# Altium schematic sheet hat.SchDoc: Wacky Racers Group 25 Hat
size A3; DrawnBy: Bailey Lissington, Drew DeWet; Address1: ECE Department; Address2: University of Canterbury; Address3: Christchurch 8041; Address4: New Zealand; Revision: 1; ImagePath: ..\UCBlack.png
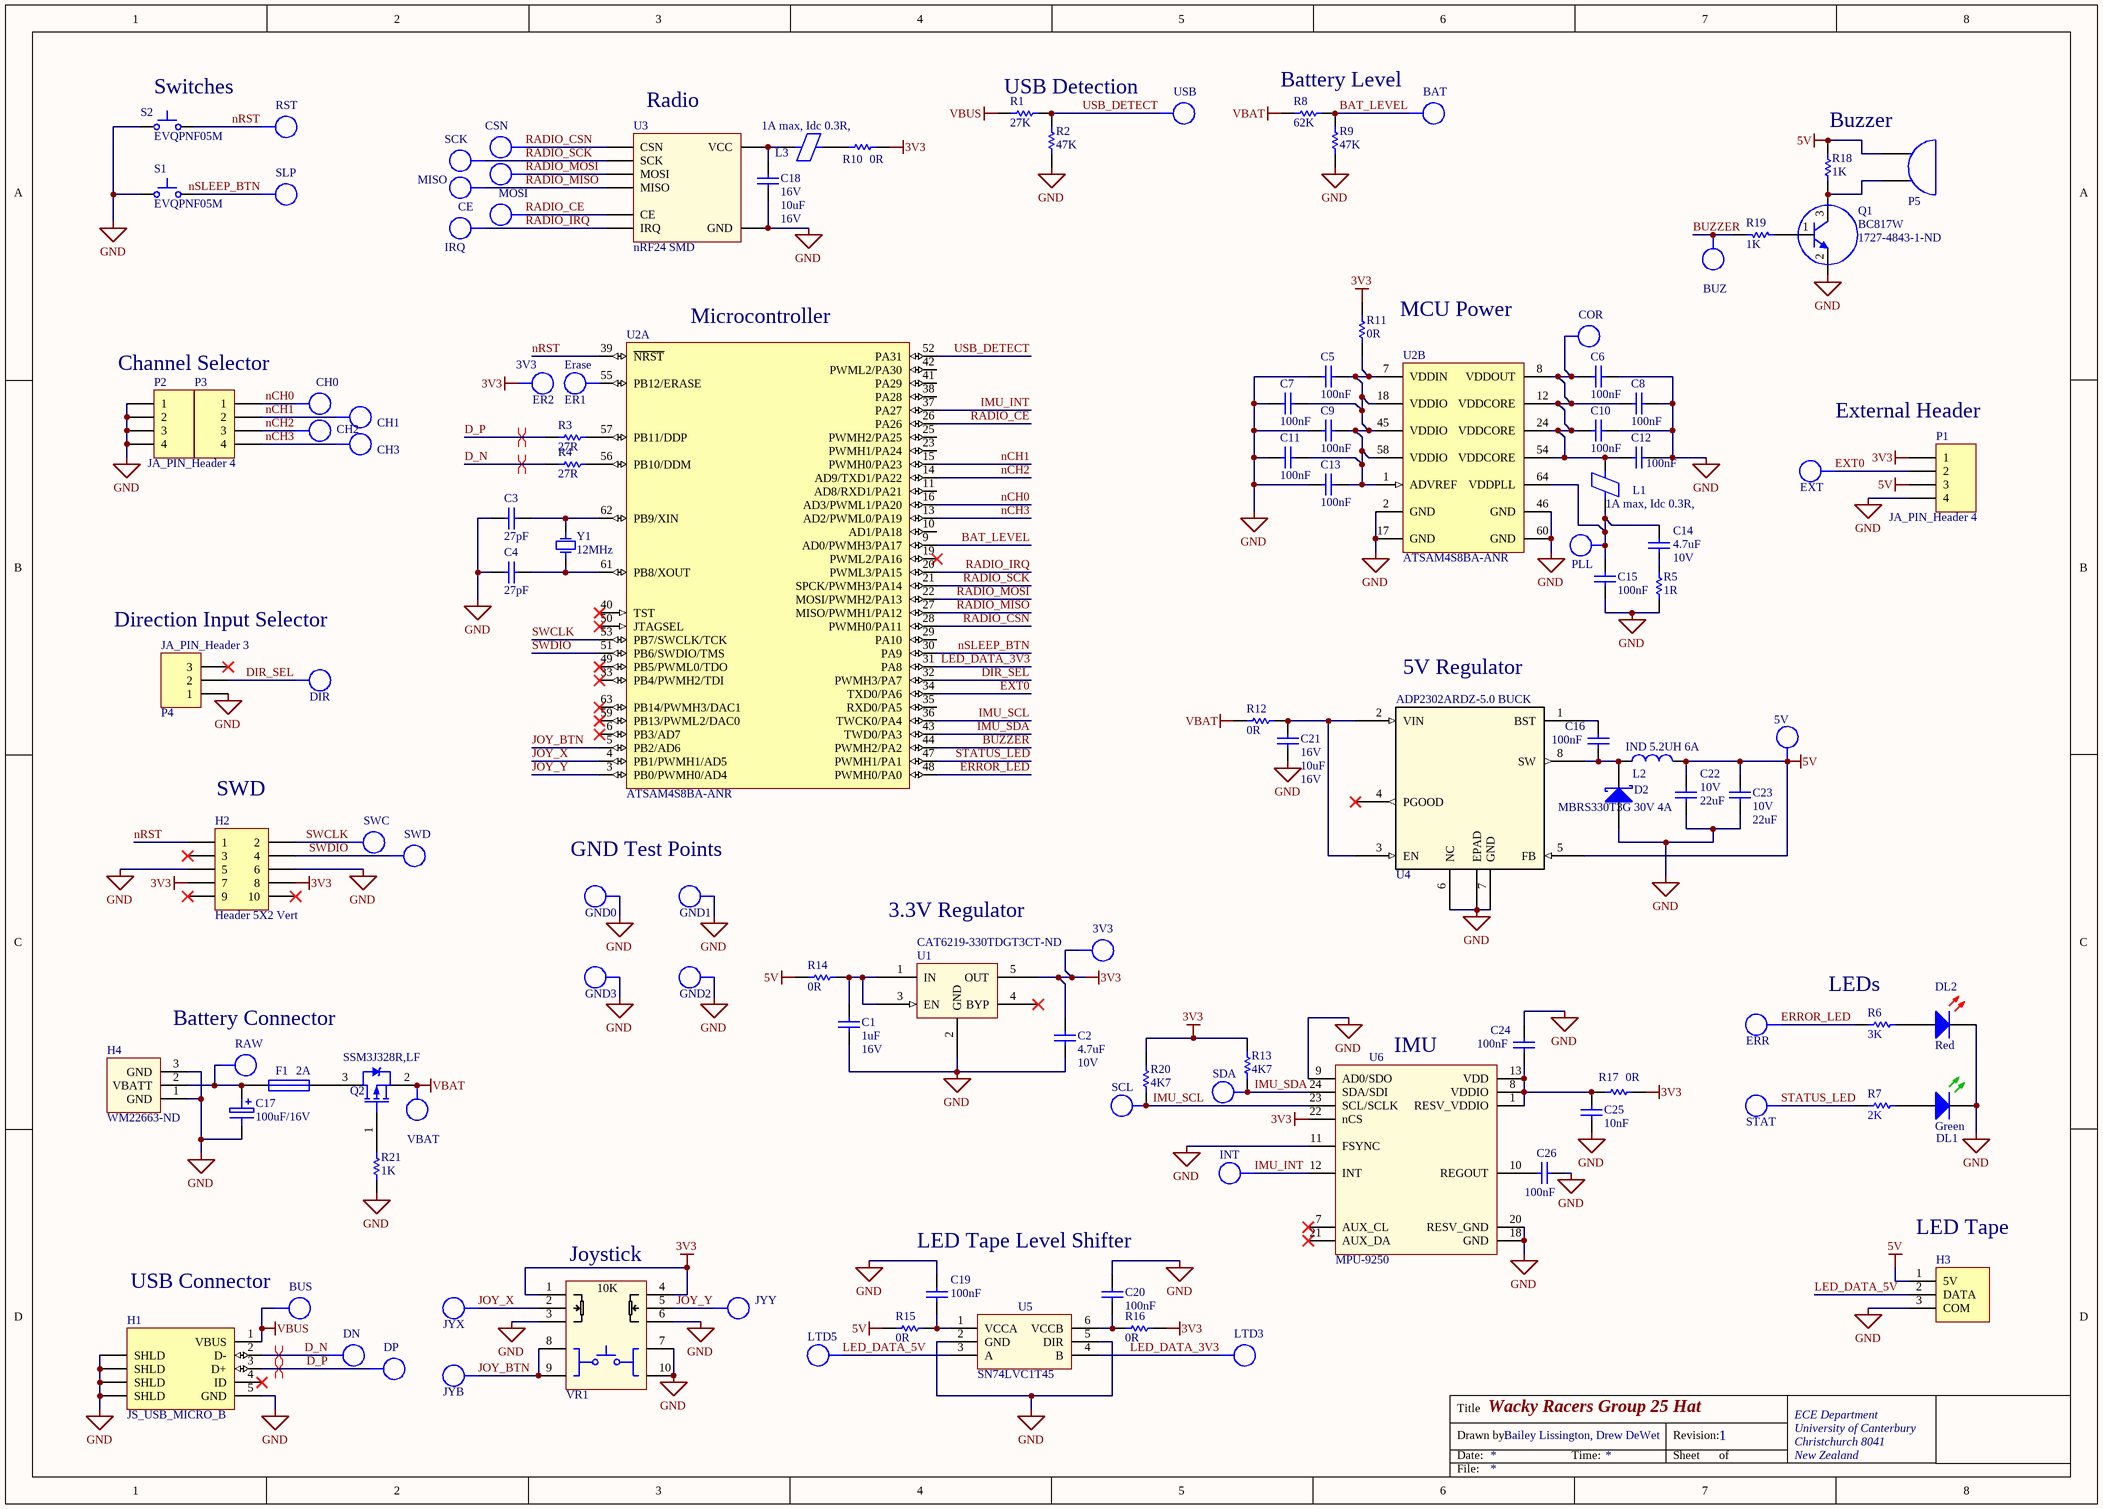
[diagram p0: hat.SchDoc]

## Parts
3V3  3V3  [TP_0603]  (value not drawn)  (no BOM)
5V  3V3  [TP_0603]  (value not drawn)  (no BOM)
BAT  3V3  [TP_0603]  (value not drawn)  (no BOM)
BUS  3V3  [TP_0603]  (value not drawn)  (no BOM)
BUZ  3V3  [TP_0603]  (value not drawn)  (no BOM)
C1  Max Voltage: 16V  [CAPC1608L]  (hidden comment: 1uF)
C2  Max Voltage: 10V  [CAPC1608N]  (hidden comment: 4.7uF)
C3  27pF  [CAPC1608L]
C4  27pF  [CAPC1608L]
C5  100nF  [CAPC1608L]
C6  100nF  [CAPC1608L]
C7  100nF  [CAPC1608L]
C8  100nF  [CAPC1608L]
C9  100nF  [CAPC1608L]
C10  100nF  [CAPC1608L]
C11  100nF  [CAPC1608L]
C12  100nF  [CAPC1608L]
C13  100nF  [CAPC1608L]
C14  Max Voltage: 10V  [CAPC1608N]  (hidden comment: 4.7uF)
C15  100nF  [CAPC1608L]
C16  100nF  [CAPC1608L]
C17  100uF/16V  [NICH-1]
C18  Voltage - Rated: 16V  [CAPC2012L]  (hidden comment: 10uF)
C19  100nF  [CAPC1608L]
C20  100nF  [CAPC1608L]
C21  Voltage - Rated: 16V  [CAPC2012L]  (hidden comment: 10uF)
C22  Max Voltage: 10V  [CAPC3216L]  (hidden comment: 22uF)
C23  Max Voltage: 10V  [CAPC3216L]  (hidden comment: 22uF)
C24  100nF  [CAPC1608L]
C25  10nF  [CAPC1608L]
C26  100nF  [CAPC1608L]
CE  3V3  [TP_0603]  (value not drawn)  (no BOM)
CH0  3V3  [TP_0603]  (value not drawn)  (no BOM)
CH1  3V3  [TP_0603]  (value not drawn)  (no BOM)
CH2  3V3  [TP_0603]  (value not drawn)  (no BOM)
CH3  3V3  [TP_0603]  (value not drawn)  (no BOM)
COR  3V3  [TP_0603]  (value not drawn)  (no BOM)
CSN  3V3  [TP_0603]  (value not drawn)  (no BOM)
D2  MBRS330T3G 30V 4A  [SMC]
DIR  3V3  [TP_0603]  (value not drawn)  (no BOM)
DL1  Green  [WL-SMCW0603]
DL2  Red  [WL-SMCW0603]
DN  3V3  [TP_0603]  (value not drawn)  (no BOM)
DP  3V3  [TP_0603]  (value not drawn)  (no BOM)
ER1  Erase  [TP_0603]  (no BOM)
ER2  3V3  [TP_0603]  (no BOM)
ERR  3V3  [TP_0603]  (value not drawn)  (no BOM)
EXT  3V3  [TP_0603]  (value not drawn)  (no BOM)
F1  2A  [RESC3216N]
GND0  TP  [TP_1206]  (value not drawn)  (no BOM)
GND1  TP  [TP_1206]  (value not drawn)  (no BOM)
GND2  TP  [TP_1206]  (value not drawn)  (no BOM)
GND3  TP  [TP_1206]  (value not drawn)  (no BOM)
H1  JS_USB_MICRO_B  [FCI_USB_10118194-0001LF]
H2  Header 5X2 Vert  [IDC2.54-V10D]
H3  3 Pin Molex KK Hdr  [MOLEX_KK_3_HDR]  (value not drawn)
H4  Supplier Part Number 1: WM22663-ND  [BATT_HEADER_3POS]  (hidden comment: Battery_HEADER_3pin)
INT  3V3  [TP_0603]  (value not drawn)  (no BOM)
IRQ  3V3  [TP_0603]  (value not drawn)  (no BOM)
JYB  3V3  [TP_0603]  (value not drawn)  (no BOM)
JYX  3V3  [TP_0603]  (value not drawn)  (no BOM)
JYY  3V3  [TP_0603]  (value not drawn)  (no BOM)
L1  1A max, Idc 0.3R,  [INDC3216L]
L2  IND 5.2UH 6A  [INDUCTOR5u2]
L3  1A max, Idc 0.3R,  [INDC3216L]
LTD3  3V3  [TP_0603]  (value not drawn)  (no BOM)
LTD5  3V3  [TP_0603]  (value not drawn)  (no BOM)
MISO  3V3  [TP_0603]  (value not drawn)  (no BOM)
MOSI  3V3  [TP_0603]  (value not drawn)  (no BOM)
P1  JA_PIN_Header 4  [HDR1X4]
P2  JA_PIN_Header 4  [HDR1X4]  (value not drawn)
P3  JA_PIN_Header 4  [HDR1X4]
P4  JA_PIN_Header 3  [HDR1X3]
P5  Piezo Buzzer  [BUZZER]  (value not drawn)
PLL  3V3  [TP_0603]  (value not drawn)  (no BOM)
Q1  Supplier Part Number 2: 1727-4843-1-ND  [SOT323_M]  (hidden comment: BC817W)
Q2  SSM3J328R,LF  [SOT23_L]
R1  27K  [RESC1608L]
R2  47K  [RESC1608N]
R3  27R  [RESC1608L]
R4  27R  [RESC1608L]
R5  1R  [RESC3216L]
R6  3K  [RESC1608L]
R7  2K  [RESC1608L]
R8  62K  [RESC1608L]
R9  47K  [RESC1608N]
R10  0R  [RESC1608L]
R11  0R  [RESC1608L]
R12  0R  [RESC1608L]
R13  4K7  [RESC1608L]
R14  0R  [RESC1608L]
R15  0R  [RESC1608L]
R16  0R  [RESC1608L]
R17  0R  [RESC1608L]
R18  1K  [RESC1608L]
R19  1K  [RESC1608L]
R20  4K7  [RESC1608L]
R21  1K  [RESC1608L]
RAW  3V3  [TP_0603]  (value not drawn)  (no BOM)
RST  3V3  [TP_0603]  (value not drawn)  (no BOM)
S1  EVQPNF05M  [EVQPNF05M]
S2  EVQPNF05M  [EVQPNF05M]
SCK  3V3  [TP_0603]  (value not drawn)  (no BOM)
SCL  3V3  [TP_0603]  (value not drawn)  (no BOM)
SDA  3V3  [TP_0603]  (value not drawn)  (no BOM)
SLP  3V3  [TP_0603]  (value not drawn)  (no BOM)
STAT  3V3  [TP_0603]  (value not drawn)  (no BOM)
SWC  3V3  [TP_0603]  (value not drawn)  (no BOM)
SWD  3V3  [TP_0603]  (value not drawn)  (no BOM)
U1  Supplier Part Number: CAT6219-330TDGT3CT-ND  [SOT95P280X145-5N]  (hidden comment: CAT6219-330TDGT3)
U2  ATSAM4S8BA-ANR  [LQFP64_L]  (parts A,B of 2)
U3  nRF24 SMD  [NRF24]
U4  ADP2302ARDZ-5.0 BUCK  [RD_8_1]
U5  SN74LVC1T45  [SOT23-6_N]
U6  MPU-9250  [Quad24]
USB  3V3  [TP_0603]  (value not drawn)  (no BOM)
VBAT  3V3  [TP_0603]  (value not drawn)  (no BOM)
VR1  Joystick 10k with Sw  [Joystick_Sw]  (value not drawn)
Y1  12MHz  [6.0X3.5-4]

## Nets
3V3: 3V3.1 C2.2 ER2.1 H2.7 H2.8 P1.1 R10.2 R11.2 R13.2 R16.2 R17.2 R20.2 U1.5(OUT) U6.22(nCS) VR1.1 VR1.4(1')
5V: 5V.1 C22.2 C23.2 H3.1(5V) L2.2 P1.3 P5.1 R14.1 R15.1 R18.2 U4.5(FB)
GND: C1.1 C2.1 C3.1 C4.1 C5.1 C6.1 C7.1 C8.1 C9.1 C10.1 C11.1 C12.1 C13.1 C15.2 C17.1 C18.1 C19.1 C20.1 C21.1 C22.1 C23.1 C24.1 C25.2 C26.2 D2.1(A) DL1.1(K) DL2.1(K) GND0.1 GND1.1 GND2.1 GND3.1 H1.5(GND) H1.6(SHLD) H2.5 H2.6 H3.3(COM) H4.1(GND) H4.3(GND) P1.4 P2.1 P2.2 P2.3 P2.4 P4.1 Q1.2 R2.1 R5.1 R9.1 R21.1 S1.1 S2.1 U1.2(GND) U2.2(GND) U2.17(GND) U2.46(GND) U2.60(GND) U3.2(GND) U4.6(NC) U4.7(GND) U4.EPAD U5.2(GND) U5.5(DIR) U6.9(AD0/SDO) U6.11(FSYNC) U6.18(GND) U6.20(RESV_GND) VR1.3 VR1.6(3') VR1.7 VR1.10
VBAT: Q2.2 R8.2 R12.1 VBAT.1
VBUS: BUS.1 H1.1(VBUS) R1.2
BAT_LEVEL: BAT.1 R8.1 R9.2 U2.9(AD0/PWMH3/PA17)
BUZZER: BUZ.1 R19.2 U2.44(PWMH2/PA2)
D_N: DN.1 H1.2(D-) R4.1
D_P: DP.1 H1.3(D+) R3.1
DIR_SEL: DIR.1 P4.2 U2.32(PWMH3/PA7)
ERROR_LED: ERR.1 R6.1 U2.48(PWMH0/PA0)
EXT0: EXT.1 P1.2 U2.34(TXD0/PA6)
IMU_INT: INT.1 U2.37(PA27) U6.12(INT)
IMU_SCL: R20.1 SCL.1 U2.36(TWCK0/PA4) U6.23(SCL/SCLK)
IMU_SDA: R13.1 SDA.1 U2.43(TWD0/PA3) U6.24(SDA/SDI)
JOY_BTN: JYB.1 U2.5(PB2/AD6) VR1.8 VR1.9
JOY_X: JYX.1 U2.4(PB1/PWMH1/AD5) VR1.2
JOY_Y: JYY.1 U2.3(PB0/PWMH0/AD4) VR1.5(2')
LED_DATA_3V3: LTD3.1 U2.31(PA8) U5.4(B)
LED_DATA_5V: H3.2(DATA) LTD5.1 U5.3(A)
nCH0: CH0.1 P3.1 U2.16(AD3/PWML1/PA20)
nCH1: CH1.1 P3.2 U2.15(PWMH0/PA23)
nCH2: CH2.1 P3.3 U2.14(AD9/TXD1/PA22)
nCH3: CH3.1 P3.4 U2.13(AD2/PWML0/PA19)
nRST: H2.1 RST.1 S2.2 U2.39(~{NRST})
nSLEEP_BTN: S1.2 SLP.1 U2.30(PA9)
RADIO_CE: CE.1 U2.26(PA26) U3.3(CE)
RADIO_CSN: CSN.1 U2.28(PWMH0/PA11) U3.4(CSN)
RADIO_IRQ: IRQ.1 U2.20(PWML3/PA15) U3.8(IRQ)
RADIO_MISO: MISO.1 U2.27(MISO/PWMH1/PA12) U3.7(MISO)
RADIO_MOSI: MOSI.1 U2.22(MOSI/PWMH2/PA13) U3.6(MOSI)
RADIO_SCK: SCK.1 U2.21(SPCK/PWMH3/PA14) U3.5(SCK)
STATUS_LED: R7.1 STAT.1 U2.47(PWMH1/PA1)
SWCLK: H2.2 SWC.1 U2.53(PB7/SWCLK/TCK)
SWDIO: H2.4 SWD.1 U2.51(PB6/SWDIO/TMS)
USB_DETECT: R1.1 R2.2 U2.52(PA31) USB.1
NetC1_2: C1.2 R14.2 U1.1(IN) U1.3(EN)
NetC3_2: C3.2 U2.62(PB9/XIN) Y1.3(OSC2)
NetC4_2: C4.2 U2.61(PB8/XOUT) Y1.1(OSC1)
NetC5_2: C5.2 C7.2 C9.2 C11.2 C13.2 R11.1 U2.1(ADVREF) U2.7(VDDIN) U2.18(VDDIO) U2.45(VDDIO) U2.58(VDDIO)
NetC6_2: C6.2 C8.2 C10.2 C12.2 COR.1 L1.2 U2.8(VDDOUT) U2.12(VDDCORE) U2.24(VDDCORE) U2.54(VDDCORE)
NetC14_1: C14.1 R5.2
NetC14_2: C14.2 C15.1 L1.1 PLL.1 U2.64(VDDPLL)
NetC16_1: C16.1 D2.2(K) L2.1 U4.8(SW)
NetC16_2: C16.2 U4.1(BST)
NetC17_2: C17.2 F1.1 H4.2(VBATT) RAW.1
NetC18_2: C18.2 L3.1 U3.1(VCC)
NetC19_2: C19.2 R15.2 U5.1(VCCA)
NetC20_2: C20.2 R16.1 U5.6(VCCB)
NetC21_2: C21.2 R12.2 U4.2(VIN) U4.3(EN)
NetC24_2: C24.2 C25.1 R17.1 U6.1(RESV_VDDIO) U6.8(VDDIO) U6.13(VDD)
NetC26_1: C26.1 U6.10(REGOUT)
NetDL1_2: DL1.2(A) R7.2
NetDL2_2: DL2.2(A) R6.2
NetER1_1: ER1.1 U2.55(PB12/ERASE)
NetF1_2: F1.2 Q2.3
NetL3_2: L3.2 R10.1
NetP5_2: P5.2 Q1.3 R18.1
NetQ1_1: Q1.1 R19.1
NetQ2_1: Q2.1 R21.2
NetR3_2: R3.2 U2.57(PB11/DDP)
NetR4_2: R4.2 U2.56(PB10/DDM)

Not connected (* = marked no-connect by the designer): H1 4(ID)*; H2 3* 9* 10*; P4 3*; U1 4(BYP)*; U2 6(PB3/AD7)* 10(AD1/PA18) 11(AD8/RXD1/PA21) 19(PWML2/PA16)* 23(PWMH1/PA24) 25(PWMH2/PA25) 29(PA10) 33(PB4/PWMH2/TDI)* 35(RXD0/PA5) 38(PA28) 40(TST)* 41(PA29) 42(PWML2/PA30) 49(PB5/PWML0/TDO)* 50(JTAGSEL)* 59(PB13/PWML2/DAC0)* 63(PB14/PWMH3/DAC1)*; U4 4(PGOOD)*; U6 7(AUX_CL)* 21(AUX_DA)*

## Layout directives
differential pair: D_N, D_P

## Notes on the sheet
- (near S2) Switches
- (near U3) Radio
- (near R1) USB Detection
- Battery Level
- Buzzer
- (near U2) Microcontroller
- MCU Power
- Channel Selector
- External Header
- Direction Input Selector
- (near U4) 5V Regulator
- (near H2) SWD
- GND Test Points
- 3.3V Regulator
- (near R6) LEDs
- Battery Connector
- (near U6) IMU
- (near VR1) Joystick
- LED Tape Level Shifter
- (near H3) LED Tape
- (near BUS) USB Connector
- Title
- Drawn by:
- Date:
- Time:
- Revision:
- Sheet
- of
- File:
- (in symbol Joystick 10k with Sw) 10K

## Library data of the parts
3V3 5V BAT BUS BUZ CE CH0-CH3 COR CSN DIR DN DP ER1 ER2 ERR EXT INT IRQ JYB JYX JYY LTD3 LTD5 MISO MOSI PLL RAW RST SCK SCL SDA SLP STAT SWC SWD USB VBAT = TP_1206: Test-Point 3.3x1.6x2.1mm SMD; Manufacturer: Harwin Inc; Manufacturer Part Number: S1751-46R; Value: TP; Manufacturer PN: *; Storage Location: ProtoPlace; Mounting Type: Surface Mount; Type: PC Test Point; Supplier 1: Digi-Key; Supplier Part Number 1: 952-1478-2-ND; Supplier 2: Farnell; Supplier Part Number 2: 1826282; Supplier: ECE Dept
C1 = CC_1uF_0603: CAP CER 1uF Y5V -20% +80% 16V 0603; PackageReference: 0603; Code_IPC: 1608 [0603]; Verify: *; Supplier: ECE Dept; Storage Location: PCB Assembly WS; Value: 1uF
C2 C14 = CC_4.7uF_0603: CAP CER 4.7uF X5R +-20%  10V 0603; Note: Footprint corresponds to dimensions for bulk cassette packaging. This case size has tightened tolerances.; PackageReference: 0805; Code_IPC: 2012[0805]; Verify: *; Supplier: ECE Dept; Storage Location: PCB Assembly WS; Value: 4.7uF
C3 C4 = CC_27pF_0603: CAP CER 27pF NPO/COG +-5% 50V 0603; PackageReference: 0603; Code_IPC: 1608 [0603]; Verify: *; Supplier: ECE Dept; Storage Location: PCB Assembly WS; Value: 27pF
C5-C13 C15 C16 C19 C20 C24 C26 = CC_100nF_0603: CAP CER 100nF X7R +-10% 50V 0603; PackageReference: 0603; Code_IPC: 1608 [0603]; Verify: *; Supplier: ECE Dept; Storage Location: PCB Assembly WS; Value: 100nF
C17 = CA_100uF_16V: CAP ALUM 100uF 16V SMD; Manufacturer PN: UWX1C101MCL1GB; Manufacturer: Nichcon; Supplier 1: Farnell; Supplier Part Number 1: 1870677; Storage Location: PCB Assembly WS; Supplier: ECE Dept; Supplier 2: Digi-Key; Supplier Part Number 2: 493-2105-1-ND; Value: 100uF/16V
C18 C21 = CC_10uF_0805_16V: CAP CER 10uF X5R 16V 0805; Manufacturer: Samsung Electro-Mechanics; Manufacturer Part Number: CL21A106KOQNNWE; Note: Footprint corresponds to dimensions for bulk cassette packaging. This case size has tightened tolerances.; Tolerance: ±10%; Notification: Current market demand for these product types have resulted in fluctuating and extending lead times. Lead times may differ.; PackageReference: 0805; Code_IPC: 2012[0805]; Supplier 1: Digi-Key; RoHS: RoHS Compliant; Category: Capacitors; Stock 1: 20000; Pricing 1: 1=0.35, 10=0.25, 100=0.1178, 500=0.08254, 1000=0.06831 (NZD); Packaging: Cut Tape (CT); Part Status: Active; Temperature Coefficient: X5R; Operating Temperature: -55°C ~ 85°C; Features: -; Ratings: -; Applications: General Purpose; Mounting Type: Surface Mount, MLCC; Package / Case: 0805 (2012 Metric); Size / Dimension: 0.079" L x 0.049" W (2.00mm x 1.25mm); Height - Seated (Max): -; Thickness (Max): 0.055" (1.40mm); Lead Spacing: -; Lead Style: -; ComponentLink1URL: http://www.samsungsem.com/kr/support/product-search/mlcc/CL21A106KOQNNWE.jsp; ComponentLink1Description: http://www.samsungsem.com/kr/support/product-search/mlcc/CL21A106KOQNNWE.jsp; Supplier Part Number 1: 1276-2894-1-ND; Value: 10uF; Max Voltage: 16V
C22 C23 = CC_22uF_1206: CAP CER 22uF Y5V -20% +80% 10V 1206; Verify: *; Supplier: ECE Dept; Storage Location: PCB Assembly WS; Dielectric: Y5V; Footprint: 1206 (3216 metric); Value: 22uF
C25 = CC_10nF_0603: CAP CER 10nF X7R +-10% 50V 0603; PackageReference: 0603; Code_IPC: 1608 [0603]; Verify: *; Supplier: ECE Dept; Storage Location: PCB Assembly WS; Value: 10nF
D2 = MBRS330T3G: SCHOTTKY  30V 4A; Manufacturer: ON Semiconductor; Speed: Fast Recovery =< 500ns, > 200mA (Io); Supplier 1: Digi-Key; Manufacturer Part Number: MBRS330T3G; RoHS: RoHS Compliant; Category: Discrete Semiconductor Products; Stock 1: 8919; Pricing 1: 1=0.93, 10=0.79, 100=0.5902, 500=0.46368, 1000=0.35829 (NZD); Packaging: Cut Tape (CT); Part Status: Active; Diode Type: Schottky; Current - Average Rectified (Io): 4A; Capacitance @ Vr, F: -; Mounting Type: Surface Mount; Package / Case: DO-214AB, SMC; Supplier Device Package: SMC; Operating Temperature - Junction: -65°C ~ 150°C; Base Part Number: MBRS330; ComponentLink1URL: http://www.onsemi.com/pub/Collateral/MBRS340T3-D.PDF; ComponentLink1Description: http://www.onsemi.com/pub/Collateral/MBRS340T3-D.PDF; Supplier Part Number 1: MBRS330T3GOSCT-ND
DL1 = DL_150060GS75000: LED Green 430mcd 0603 SMD; Manufacturer: WURTH ELEKTRONIK; Forward Current If: 30; Wavelength Typ: 520; Forward Voltage: 3.2; Lens Shape: Rectangular; Luminous Intensity: 430; Viewing Angle: 140°; LED Mounting: SMD; Supplier 1: Farnell; Supplier Part Number 1: 2322070; Manufacturer Part Number: 150060GS75000; Storage Location: PCB Assembly WS; Supplier: ECE Dept; LED Colour: Green
DL2 = DL_150060RS75000: LED Red 250mcd 0603 SMD; Manufacturer: WURTH ELEKTRONIK; Forward Current If: 30; Forward Voltage: 2; Lens Shape: Rectangular; Luminous Intensity: 250; Wavelength Typ: 625; Viewing Angle: 140°; LED Mounting: SMD; Supplier 1: Farnell; Supplier Part Number 1: 2322071; Manufacturer Part Number: 150060RS75000; Storage Location: PCB Assembly WS; Supplier: ECE Dept; LED Colour: Red
F1 = FS_Fuse_2.0A: Fuse 2.0A Very Fast Acting 1206 SMD; Manufacturer: MULTICOMP; Manufacturer PN: MC12CF 002; Supplier: ECE Dept; Storage Location: PCB Assembly WS; Supplier 1: Farnell; Supplier Part Number 1: 1841029; Manufacturer Part Number: MC12CF 002; Value: 2A
GND0-GND3 = TP_1206: Test-Point 3.3x1.6x2.1mm SMD; Manufacturer: Harwin Inc; Manufacturer Part Number: S1751-46R; Manufacturer PN: *; Storage Location: ProtoPlace; Mounting Type: Surface Mount; Type: PC Test Point; Supplier 1: Digi-Key; Supplier Part Number 1: 952-1478-2-ND; Supplier 2: Farnell; Supplier Part Number 2: 1826282; Supplier: ECE Dept; Value: TP
H1 = JS_USB_MICRO_B_SMT: CONN USB MICRO B RECPT SMT R/A; Manufacturer: FCI; Manufacturer Part Number: 10118194-0001LF; Gender: Receptacle; Number of Contacts: 5; Specifications: USB 2.0; Supplier 1: Digi-Key; Supplier Part Number 1: 609-4618-1-ND; Features: Shielded, Solder Retention; Mounting Type: Surface Mount, Right Angle, Horizontal
H2 = JA_HDR_IDC_5X2_VERT: IDC Header, 2,54mm, 10-Pin, Vert; Supplier: ECE Dept; Supplier 1: Farnell; Supplier Part Number 1: 1096985; Storage Location: ECE Dept Store
H3 = LED_Strip_Header: CONN HEADER 3POS 2.54mm VERT_Thru Hole; Manufacturer: Molex; Manufacturer PN: 22-23-2031; Supplier Part Number 1: 9731156; Supplier: ECE Dept; Supplier 1: Farnell; Storage Location: ECE Dept Store; Value: 3 Pin Molex KK Hdr
H4 = Battery_HEADER_3pin: 3Pin Header 2.54mm spacing / Digikey #WM22663-ND; Supplier 1: Digi-Key
L1 L3 = IN_Ferrite-Bead: Ferrite Bead, Rdc 0.3R, Z100MHZ 600R, Imax 1A, SMD 1206; Manufacturer: FAIR-RITE; Manufacturer PN: 2512066017Y1; DC Current Rating: 1; DC Resistance Max: 0.08; Ferrite Case Style: 1206 ^3216 Metric]; Frequency Range: 50MHz to 1; Impedance: 600; Impedance Tolerance: ± 25%; Supplier: ECE Dept; Storage Location: PCB Assembly WS; Ferrite Mounting: SMD; Supplier 1: Farnell; Supplier Part Number 1: 1612060; Manufacturer Part Number: 2512066017Y1; Value: 1A max, Idc 0.3R,
L2 = CDRH104RNP-5R2NC: FIXED IND 5.2UH 6A 22 MOHM SMD; Manufacturer: Sumida America Components Inc.; Material - Core: Ferrite; Tolerance: ±30%; Current - Saturation: 5.6A; Shielding: Shielded; DC Resistance (DCR): 22 mOhm Max; Supplier 1: Digi-Key; Manufacturer Part Number: CDRH104RNP-5R2NC; RoHS: RoHS Compliant; Category: Inductors, Coils, Chokes; Stock 1: 3849; Pricing 1: 1=2.9, 10=2.678, 100=1.8743, 500=1.5173 (NZD); Packaging: Cut Tape (CT); Part Status: Active; Type: -; Q @ Freq: -; Frequency - Self Resonant: -; Ratings: -; Operating Temperature: -40°C ~ 100°C; Mounting Type: Surface Mount; Package / Case: Nonstandard; Supplier Device Package: -; Size / Dimension: 0.402" L x 0.394" W (10.20mm x 10.00mm); Height - Seated (Max): 0.157" (4.00mm); ComponentLink1URL: http://products.sumida.com/products/pdf/CDRH104R.pdf; ComponentLink1Description: http://products.sumida.com/products/pdf/CDRH104R.pdf; Supplier Part Number 1: 308-2280-1-ND
P1-P3 = JA_PIN_Header 4: Header, 4-Pin; LatestRevisionDate: 17-Jul-2002; LatestRevisionNote: Re-released for DXP Platform.; Publisher: Altium Limited
P4 = JA_PIN_Header 3: Header, 3-Pin; LatestRevisionDate: 17-Jul-2002; LatestRevisionNote: Re-released for DXP Platform.; Publisher: Altium Limited
P5 = Piezo Buzzer: TDK - PS1240P02BT - BUZZER, PIEZO, 70DB, 12.2MM; Number of Terminals/Pins: 2; Frequency: 4kHz; Operating Supply Voltage: 3V; Washable: No; Supplier 1: Digi-Key; Manufacturer 1: TDK; Manufacturer Part Number 1: PS1240P02BT; Stock 1: 24025; Pricing 1: 1=0.61000, 10=0.52500, 25=0.49120, 50=0.46580, 100=0.44110 (USD); RoHS: Yes; Mount: Through Hole; Number of Pins: 2; Min Operating Temperature: -10°C; Max Operating Temperature: 70°C; Package Quantity: 1; Packaging: Tape and Reel; Termination: PC Pins; Voltage Rating (DC): 3V; Series: PS; Diameter: 12.2mm; Height: 6.5mm; Lead Free: Lead Free; RoHS Compliant: Yes; ComponentLink1URL: https://datasheet.ciiva.com/0/ef532-ps-112.pdf?src-supplier=Digi-Key; ComponentLink1Description: https://datasheet.ciiva.com/0/ef532-ps-112.pdf?src-supplier=Digi-Key; ComponentLink2URL: https://datasheet.ciiva.com/0/ef532-ps-111.pdf?src-supplier=Digi-Key; ComponentLink2Description: https://datasheet.ciiva.com/0/ef532-ps-111.pdf?src-supplier=Digi-Key; ComponentLink3URL: https://datasheet.ciiva.com/3306/ef532-ps-3306958.pdf?src-supplier=Avnet; ComponentLink3Description: https://datasheet.ciiva.com/3306/ef532-ps-3306958.pdf?src-supplier=Avnet; ComponentLink4URL: https://datasheet.ciiva.com/16225/ef532-ps-16225062.pdf?src-supplier=Onlinecomponents.com; ComponentLink4Description: https://datasheet.ciiva.com/16225/ef532-ps-16225062.pdf?src-supplier=Onlinecomponents.com; Supplier Part Number 1: 445-2525-1-ND
Q1 = TB_BC817W: NPN GP Bipolar Transistor 45V 500mA SOT323; Manufacturer: NXP; Supplier 1: Farnell; Supplier Part Number 1: 2114873; Manufacturer PN: BC817W; Storage Location: PCB Assembly WS; Supplier: ECE Dept; Supplier 2: Digi-Key; Value: BC817W
Q2 = TM_SSM3J328R: MOSFET P-CH 20V 6A SOT23-3; Manufacturer: Toshiba; FET Feature: Logic Level Gate, 1.5V Drive; FET Type: MOSFET P-Channel, Metal Oxide; Gate Charge (Qg) @ Vgs: 12.8nC @ 4.5V; Input Capacitance (Ciss) @ Vds: 840pF @ 10V; Power - Max: 1W; Rds On Max: 29.8mR; Drain to Source Resistance: 47.4mR; Turn-On Delay Time: 32ns; Power Dissipation: 2W; Number of Channels: 1; Turn-Off Delay Time: 107ns; Gate to Source Voltage (Vgs): 8V; Input Capacitance: 840pF; Element Configuration: Single; Drain to Source Breakdown Voltage: -20V; Vgs(th) (Max) @ Id: 1V @ 1mA; Current - Continuous Drain (Id) @ 25° C: 6A; Drain to Source Voltage (Vdss): 20V; Package / Case: SOT-23-3 Flat Leads; Supplier Device Package: SOT-23F; Pricing: 1=0.79, 10=0.658, 25=0.5772, 100=0.4939, 250=0.42836, 500=0.36284, 1000=0.27972 (NZD); Storage Location: PCB Assembly WS; Supplier: Digi-Key; ComponentLink1URL: https://datasheet.ciiva.com/11158/ssm3j328r-datasheet-en-20140301-11158652.pdf; ComponentLink1Description: https://datasheet.ciiva.com/11158/ssm3j328r-datasheet-en-20140301-11158652.pdf; Supplier Part Number: SSM3J328RLFDKR-ND; Max Operating Temperature: 150°C; Mount: Surface Mount; Packaging: Tape and Reel; Min Operating Temperature: -55°C; Continuous Drain Current (ID): 6A; Radiation Hardening: No; Max Power Dissipation: 1W; Package Quantity: 3000; Case/Package: SOT-23-3; Number of Pins: 3; Number of Elements: 1; Supplier 1: Digi-Key; Supplier Part Number 1: SSM3J328RLFDKR-ND; Manufacturer Part Number: SSM3J328R,LF
R1 = RS_27K: RES 27K OHM 1/10W 5% 0603 SMD; Storage Location: PCB Assembly WS; Supplier: ECE Dept; Value: 27K
R2 R9 = RS_47K: RES 47.0K OHM 1/10W 5% 0603 SMD; Storage Location: PCB Assembly WS; Supplier: ECE Dept; Value: 47K
R3 R4 = RS_27R: RES 27 OHM 1/10W 5% 0603 SMD; Storage Location: PCB Assembly WS; Supplier: ECE Dept; Value: 27R
R5 = RT_1R: RES 1R OHM 1/4W 5% 1206 SMD; Storage Location: PCB Assembly WS; Supplier: ECE Dept; Value: 1R
R6 = RS_3K: RES 3K OHM 1/10W 5% 0603 SMD; Storage Location: PCB Assembly WS; Supplier: ECE Dept; Value: 3K
R7 = RS_2K: RES 2K OHM 1/10W 5% 0603 SMD; Storage Location: PCB Assembly WS; Supplier: ECE Dept; Value: 2K
R8 = RS_62K: RES 62.0K OHM 1/10W 5% 0603 SMD; Storage Location: PCB Assembly WS; Supplier: ECE Dept; Value: 62K
R10-R12 R14-R17 = RS_0R0: RES 0.0 OHM 1/10W 5% 0603 SMD; Storage Location: PCB Assembly WS; Supplier: ECE Dept; Value: 0R
R13 R20 = RS_4K7: RES 4.7K OHM 1/10W 5% 0603 SMD; Storage Location: PCB Assembly WS; Supplier: ECE Dept; Value: 4K7
R18 R19 R21 = RS_1K: RES 1.0K OHM 1/10W 5% 0603 SMD; Storage Location: PCB Assembly WS; Supplier: ECE Dept; Value: 1K
S1 S2 = WS_EVQPNF05M: Panasonic 6 x 3.5mm SMD Light Touch Switch Type SMD; PackageDescription: 6.0 x 3.5 mm; Supplier 1: Farnell; Supplier Part Number 1: 2079481; Manufacturer: Panasonic; Manufacturer PN: EVQPNF05M; Supplier 2: Digi-Key; Supplier Part Number 2: P13598SCT-ND; Storage Location: PCB Assembly WS; Supplier: ECE Dept
U1 = SV_CAT6219-330TDGT3: IC REG LIN 3.3V 500MA TSOT23-5; Voltage - Input (Max): 5.5V; Voltage Dropout (Max): 0.5V @ 500mA; Manufacturer Part Number: CAT6219-330TDGT3; Base Part Number: CAT6219; Current - Output: 500mA; Package / Case: SOT-23-5 Thin, TSOT-23-5; Supplier: Digi-Key; Supplier Device Package: TSOT-23-5; Voltage - Output (Min/Fixed): 3.3V; ComponentLink1URL: http://www.onsemi.com/pub/Collateral/CAT6219-D.PDF; ComponentLink1Description: http://www.onsemi.com/pub/Collateral/CAT6219-D.PDF; Supplier 1: Digi-Key
U2 = SE_ATSAM4S16BA-MU: IC MCU 32BIT 512KB FLASH 64LQFP; Manufacturer: Atmel; Connectivity: I²C, IrDA, Memory Card, SPI, SSC, UART/USART, USB; Core Processor: ARM® Cortex®-M4; Core Size: 32-Bit; Data Converters: A/D 11x12b, D/A 2x12b; Number of I/O: 47; Peripherals: Brown-out Detect/Reset, DMA, POR, PWM, WDT; Program Memory Size: 512KB (512K x 8); RAM Size: 128K x 8; Speed: 120MHz; Voltage - Supply (Vcc/Vdd): 1.62 V ~ 3.6 V; PackageVersion: revJ, Jul-2007; PackageReference: 64PS; PackageDescription: 64-Pin Quad Flat No-Lead (QFN) Sawn, 9 x 9 x 1.0 mm Body, 0.5 mm Pitch, Exposed Pad; Code_JEDEC: MO-220VMMD-3; ComponentLink1Description: Manufacturer URL; ComponentLink1URL: http://www.atmel.com/; ComponentLink2Description: SAM4S Series Datasheet; ComponentLink2URL: http://www.atmel.com/dyn/resources/prod_documents/11100.pdf; ComponentLink3Description: SAM4S Series Summary; ComponentLink3URL: http://www.atmel.com/dyn/resources/prod_documents/11100S.pdf; Supplier 1: Digi-Key; Package / Case: 64-LQFP; Packaging: Cut Tape (CT); Program Memory Type: FLASH; Supplier Part Number 1: ATSAM4S8BA-ANRCT-ND; Manufacturer Part Number: ATSAM4S8BA-ANR
U3 = NRF24: nRF24 SMD Module; Warning: No power planes near or under device
U4 = ADP2302ARDZ-5.0-R7: IC REG BUCK 5V 2A 8SOIC; Vendor: Analog Devices Inc; Frequency - Switching: 700kHz; Output Type: Fixed; Voltage - Input (Max): 20V; Manufacturer_Part_Number: ADP2302ARDZ-5.0-R7; Type: DEV; Value: Value; Supplier 1: Digi-Key; Current - Output: 2A; Voltage - Output (Min/Fixed): 5V; Supplier Part Number 1: ADP2302ARDZ-5.0-R7CT-ND
U5 = SN74LVC1T45: 1.8V - 5V level converter
U6 = MPU-9250: 9 axis IMU
VR1 = Joystick 10k with Sw: JOYSTICK 10K OHM 2 AXIS TH; Manufacturer 1: SparkFun; Manufacturer Part Number 1: COM-09032; Supplier 1: Digi-Key; Stock 1: 563; Pricing 1: 1=3.95000 (USD); RoHS: No; ComponentLink1URL: https://media.digikey.com/pdf/Data%20Sheets/Sparkfun%20PDFs/COM-09032_Web.pdf?src-supplier=Digi-Key; ComponentLink1Description: https://media.digikey.com/pdf/Data%20Sheets/Sparkfun%20PDFs/COM-09032_Web.pdf?src-supplier=Digi-Key; Supplier Part Number 1: 1568-1526-ND
Y1 = XT_CRYSTAL_12MHz_18pF: CRYSTAL 12MHZ 18PF 6X3.5mm SMD; Manufacturer: CTS-Frequency Controls; Manufacturer Part Number: 406C35D12M00000; ESR (Equivalent Series Resistance): 60 Ohm; Frequency Stability: ±50ppm; Frequency Tolerance: ±30ppm; Operating Mode: Fundamental; Supplier 1: Digi-Key; Height: 0.047" (1.20mm); Load Capacitance: 18pF; Mounting Type: Surface Mount; Operating Temperature: -20°C ~ 70°C; Package / Case: 4-SMD, No Lead (DFN, LCC); Size / Dimension: 0.236" L x 0.138" W (6.00mm x 3.50mm); Supplier Part Number 1: CTX855CT-ND; Frequency: 12MHz